# EasyEDA schematic Schematic.json
TITLE: Sheet_1; REV: 1.0; Date: 2026-01-20; Sheet: 1/1; Drawn By: rudravenommishra; Company: Your Company
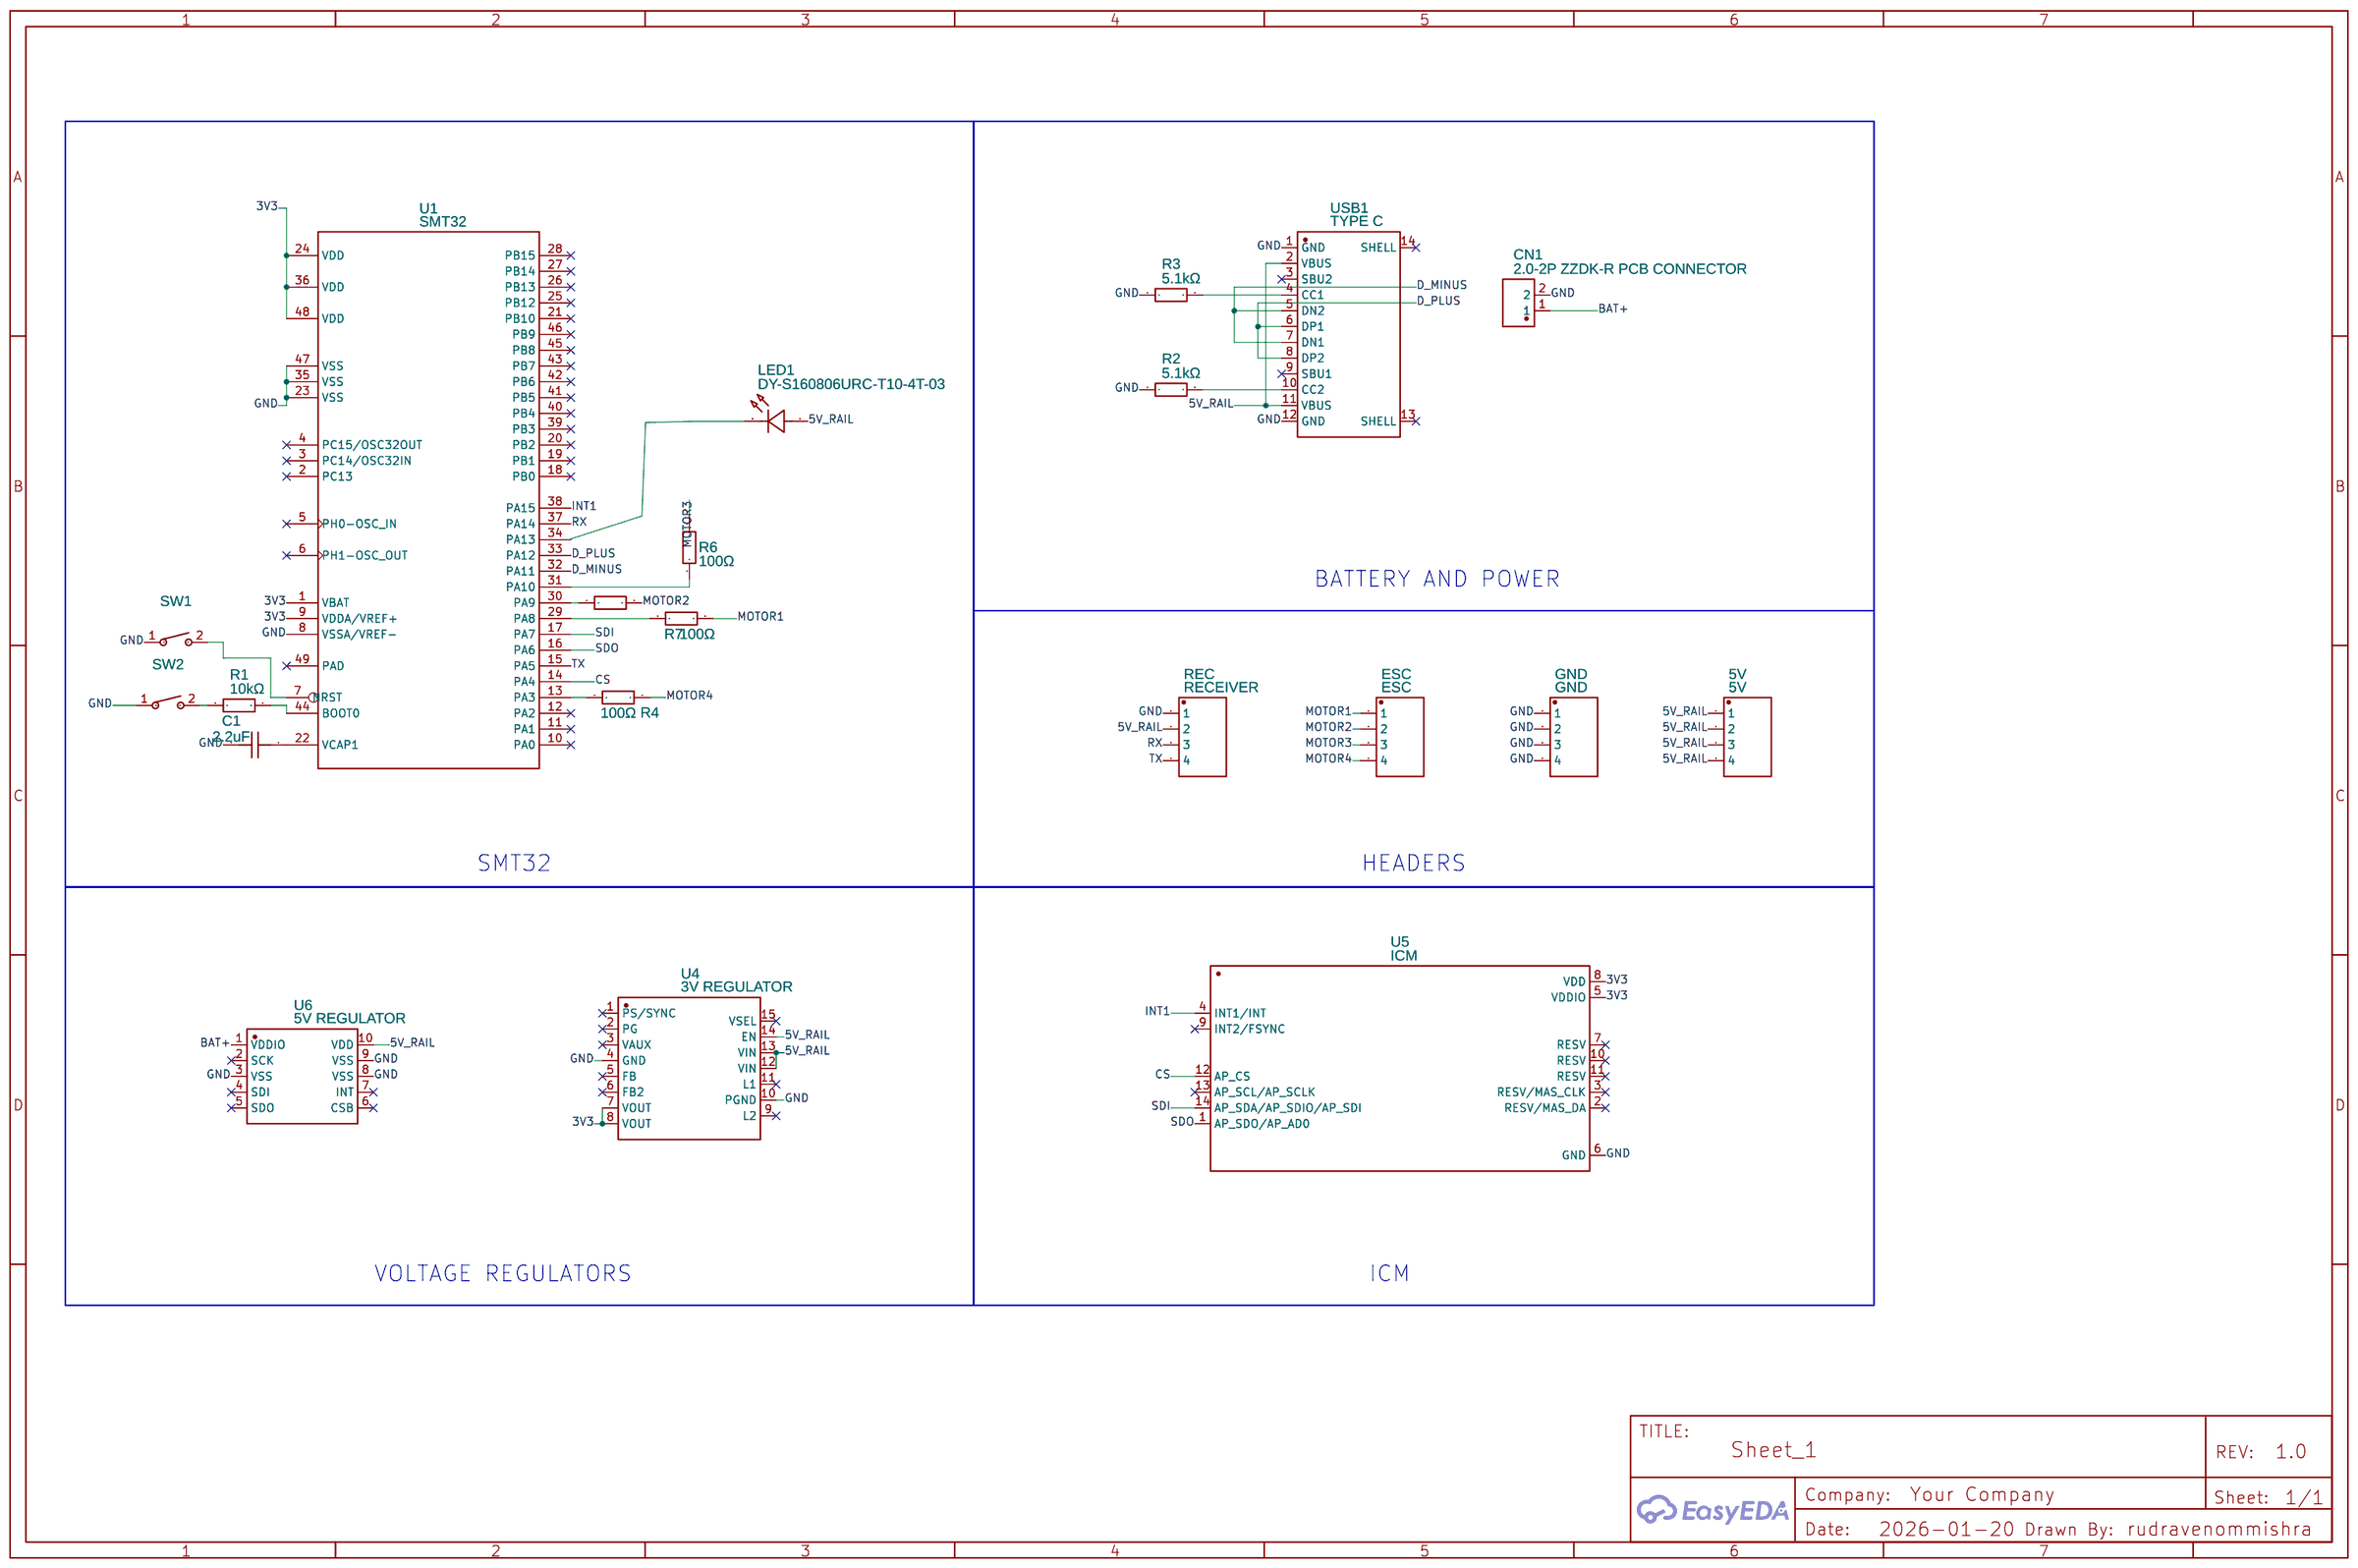
[diagram p0: schematic sheet]

## Parts
5V  5V  [HDR-TH_4P-P2.54-V-M]
C1  2.2uF  [C1206]
CN1  2.0-2P ZZDK-R PCB CONNECTOR  [CONN-TH_2.0-2P-ZZDK-R-PCB-CONNECTOR]
ESC  ESC  [HDR-TH_4P-P2.54-V-M]
GND  GND  [HDR-TH_4P-P2.54-V-M]
LED1  DY-S160806URC-T10-4T-03  [LED0603-RD_1]
R1  10kΩ  [R0805]
R2  5.1kΩ  [R0402]
R3  5.1kΩ  [R0402]
R4  100Ω  [R01005]
R5  100Ω  [R01005]
R6  100Ω  [R01005]
R7  100Ω  [R01005]
REC  RECEIVER  [HDR-TH_4P-P2.54-V-M]
SW1  HX 3X4X2-2P-1.6N TACTILE SWITCH  [KEY-SMD_L4.0-W3.0-LS4.9-1]
SW2  HX 3X4X2-2P-1.6N TACTILE SWITCH  [KEY-SMD_L4.0-W3.0-LS4.9-1]
U1  SMT32  [UFQFPN-48_L7.0-W7.0-P0.50-BL-EP]
U4  3V REGULATOR  [VQFN-HR-15_L3.0-W2.5-P0.50-BL_TPS63070RNMR]
U5  ICM  [LGA-14_L3.0-W2.5-P0.50-TL]
U6  5V REGULATOR  [LGA-10_L2.0-W2.0-P0.50-TL_BMP580]
USB1  TYPE C  [USB-C-SMD_TYPE-C-6PIN-2MD-073]

## Library data of the parts
5V ESC GND REC = Header-Male-2.54_1x4: Contributor: LCSC; Supplier: LCSC; Manufacturer: Ckmtw(灿科盟); Manufacturer Part: B-2100S04P-A110; Supplier Part: C124378; JLCPCB Part Class: Extended Part
C1 = 1206X225K250NT: Supplier: LCSC; Supplier Part: C20616254; Manufacturer: FH(风华); JLCPCB Part Class: Extended Part; Contributor: lcsc
CN1 = 2.0-2P ZZDK-R PCB CONNECTOR: Supplier: LCSC; Supplier Part: C49023773; Manufacturer: SHOU HAN(首韩); Manufacturer Part: 2.0-2P ZZDK-R PCB Connector; JLCPCB Part Class: Extended Part; Contributor: lcsc
LED1 = DY-S160806URC-T10-4T-03: Supplier: LCSC; Supplier Part: C6276856; Manufacturer: TONYU(东裕); Contributor: lcsc; JLCPCB Part Class: Extended Part
R1 = PTFR0805B10K0P9: Contributor: LCSC; Supplier: LCSC; Supplier Part: C478887; Manufacturer: RESI(开步睿思); JLCPCB Part Class: Extended Part
R2 R3 = 0402WGF5101TCE: Supplier: LCSC; Manufacturer: UNI-ROYAL(厚声); Supplier Part: C25905; JLCPCB Part Class: Basic Part
R4-R7 = 0105WHF1000TDE: Contributor: LCSC; Supplier: LCSC; Supplier Part: C270307; Manufacturer: UNI-ROYAL(厚声); JLCPCB Part Class: Extended Part
SW1 SW2 = HX 3X4X2-2P-1.6N TACTILE SWITCH: Supplier: LCSC; Supplier Part: C49234124; Manufacturer: hanxia(韩下); Manufacturer Part: HX 3x4x2-2P-1.6N TACTILE SWITCH; JLCPCB Part Class: Extended Part; Contributor: lcsc
U1 = STM32F411CEU6: Supplier: LCSC; Manufacturer: ST(意法半导体); Supplier Part: C60420; JLCPCB Part Class: Extended Part
U4 = TPS630701RNMR: Contributor: LCSC; Supplier: LCSC; Supplier Part: C2876599; Manufacturer: TI(德州仪器); JLCPCB Part Class: Extended Part
U5 = ICM-45605: Supplier: LCSC; Supplier Part: C38673635; Manufacturer: TDK InvenSense(应美盛); Contributor: lcsc; JLCPCB Part Class: Extended Part
U6 = BMP580: Supplier: LCSC; Supplier Part: C22391138; Manufacturer: Bosch(博世); JLCPCB Part Class: Extended Part; Contributor: lcsc
USB1 = TYPE-C 16PIN 2MD(073): Contributor: LCSC; Supplier: LCSC; Supplier Part: C2765186; Manufacturer: SHOU HAN(首韩); JLCPCB Part Class: Extended Part

## Nets
3V3: U1.1(VBAT) U1.9(VDDA/VREF+) U1.24(VDD) U1.36(VDD) U1.48(VDD) U4.7(VOUT) U4.8(VOUT) U5.5(VDDIO) U5.8(VDD)
5V_RAIL: 5V.1 5V.2 5V.3 5V.4 LED1.2(A) REC.2 U4.12(VIN) U4.13(VIN) U4.14(EN) U6.10(VDD) USB1.2(VBUS) USB1.11(VBUS)
GND: C1.1 CN1.2 GND.1 GND.2 GND.3 GND.4 R2.1 R3.1 REC.1 SW1.1 SW2.1 U1.8(VSSA/VREF-) U1.23(VSS) U1.35(VSS) U1.47(VSS) U4.4(GND) U4.10(PGND) U5.6(GND) U6.3(VSS) U6.8(VSS) U6.9(VSS) USB1.1(GND) USB1.12(GND)
BAT+: CN1.1 U6.1(VDDIO)
CS: U1.14(PA4) U5.12(AP_CS)
D_MINUS: U1.32(PA11) USB1.5(DN2) USB1.7(DN1)
D_PLUS: U1.33(PA12) USB1.6(DP1) USB1.8(DP2)
INT1: U1.38(PA15) U5.4(INT1/INT)
MOTOR1: ESC.1 R7.2
MOTOR2: ESC.2 R5.2
MOTOR3: ESC.3 R6.2
MOTOR4: ESC.4 R4.2
RX: REC.3 U1.37(PA14)
SDI: U1.17(PA7) U5.14(AP_SDA/AP_SDIO/AP_SDI)
SDO: U1.16(PA6) U5.1(AP_SDO/AP_AD0)
TX: REC.4 U1.15(PA5)
Net-(C1-2): C1.2 U1.22(VCAP1)
Net-(LED1-1): LED1.1(K) U1.34(PA13)
Net-(R1-1): R1.1 SW2.2
Net-(R1-2): R1.2 U1.44(BOOT0)
Net-(R2-2): R2.2 USB1.10(CC2)
Net-(R3-2): R3.2 USB1.4(CC1)
Net-(R4-1): R4.1 U1.13(PA3)
Net-(R5-1): R5.1 U1.30(PA9)
Net-(R6-1): R6.1 U1.31(PA10)
Net-(R7-1): R7.1 U1.29(PA8)
Net-(SW1-2): SW1.2 U1.7(NRST)

Not connected (* = marked no-connect by the designer): U1 2(PC13)* 3(PC14/OSC32IN)* 4(PC15/OSC32OUT)* 5(PH0-OSC_IN)* 6(PH1-OSC_OUT)* 10(PA0)* 11(PA1)* 12(PA2)* 18(PB0)* 19(PB1)* 20(PB2)* 21(PB10)* 25(PB12)* 26(PB13)* 27(PB14)* 28(PB15)* 39(PB3)* 40(PB4)* 41(PB5)* 42(PB6)* 43(PB7)* 45(PB8)* 46(PB9)* 49(PAD)*; U4 1(PS/SYNC)* 2(PG)* 3(VAUX)* 5(FB)* 6(FB2)* 9(L2)* 11(L1)* 15(VSEL)*; U5 2(RESV/MAS_DA)* 3(RESV/MAS_CLK)* 7(RESV)* 9(INT2/FSYNC)* 10(RESV)* 11(RESV)* 13(AP_SCL/AP_SCLK)*; U6 2(SCK)* 4(SDI)* 5(SDO)* 6(CSB)* 7(INT)*; USB1 3(SBU2)* 9(SBU1)* 13(SHELL)* 14(SHELL)*

## Notes on the sheet
- BATTERY AND POWER
- SMT32
- HEADERS
- VOLTAGE REGULATORS
- ICM
